# EAGLE design joltjs (EAGLE 7.7.0)
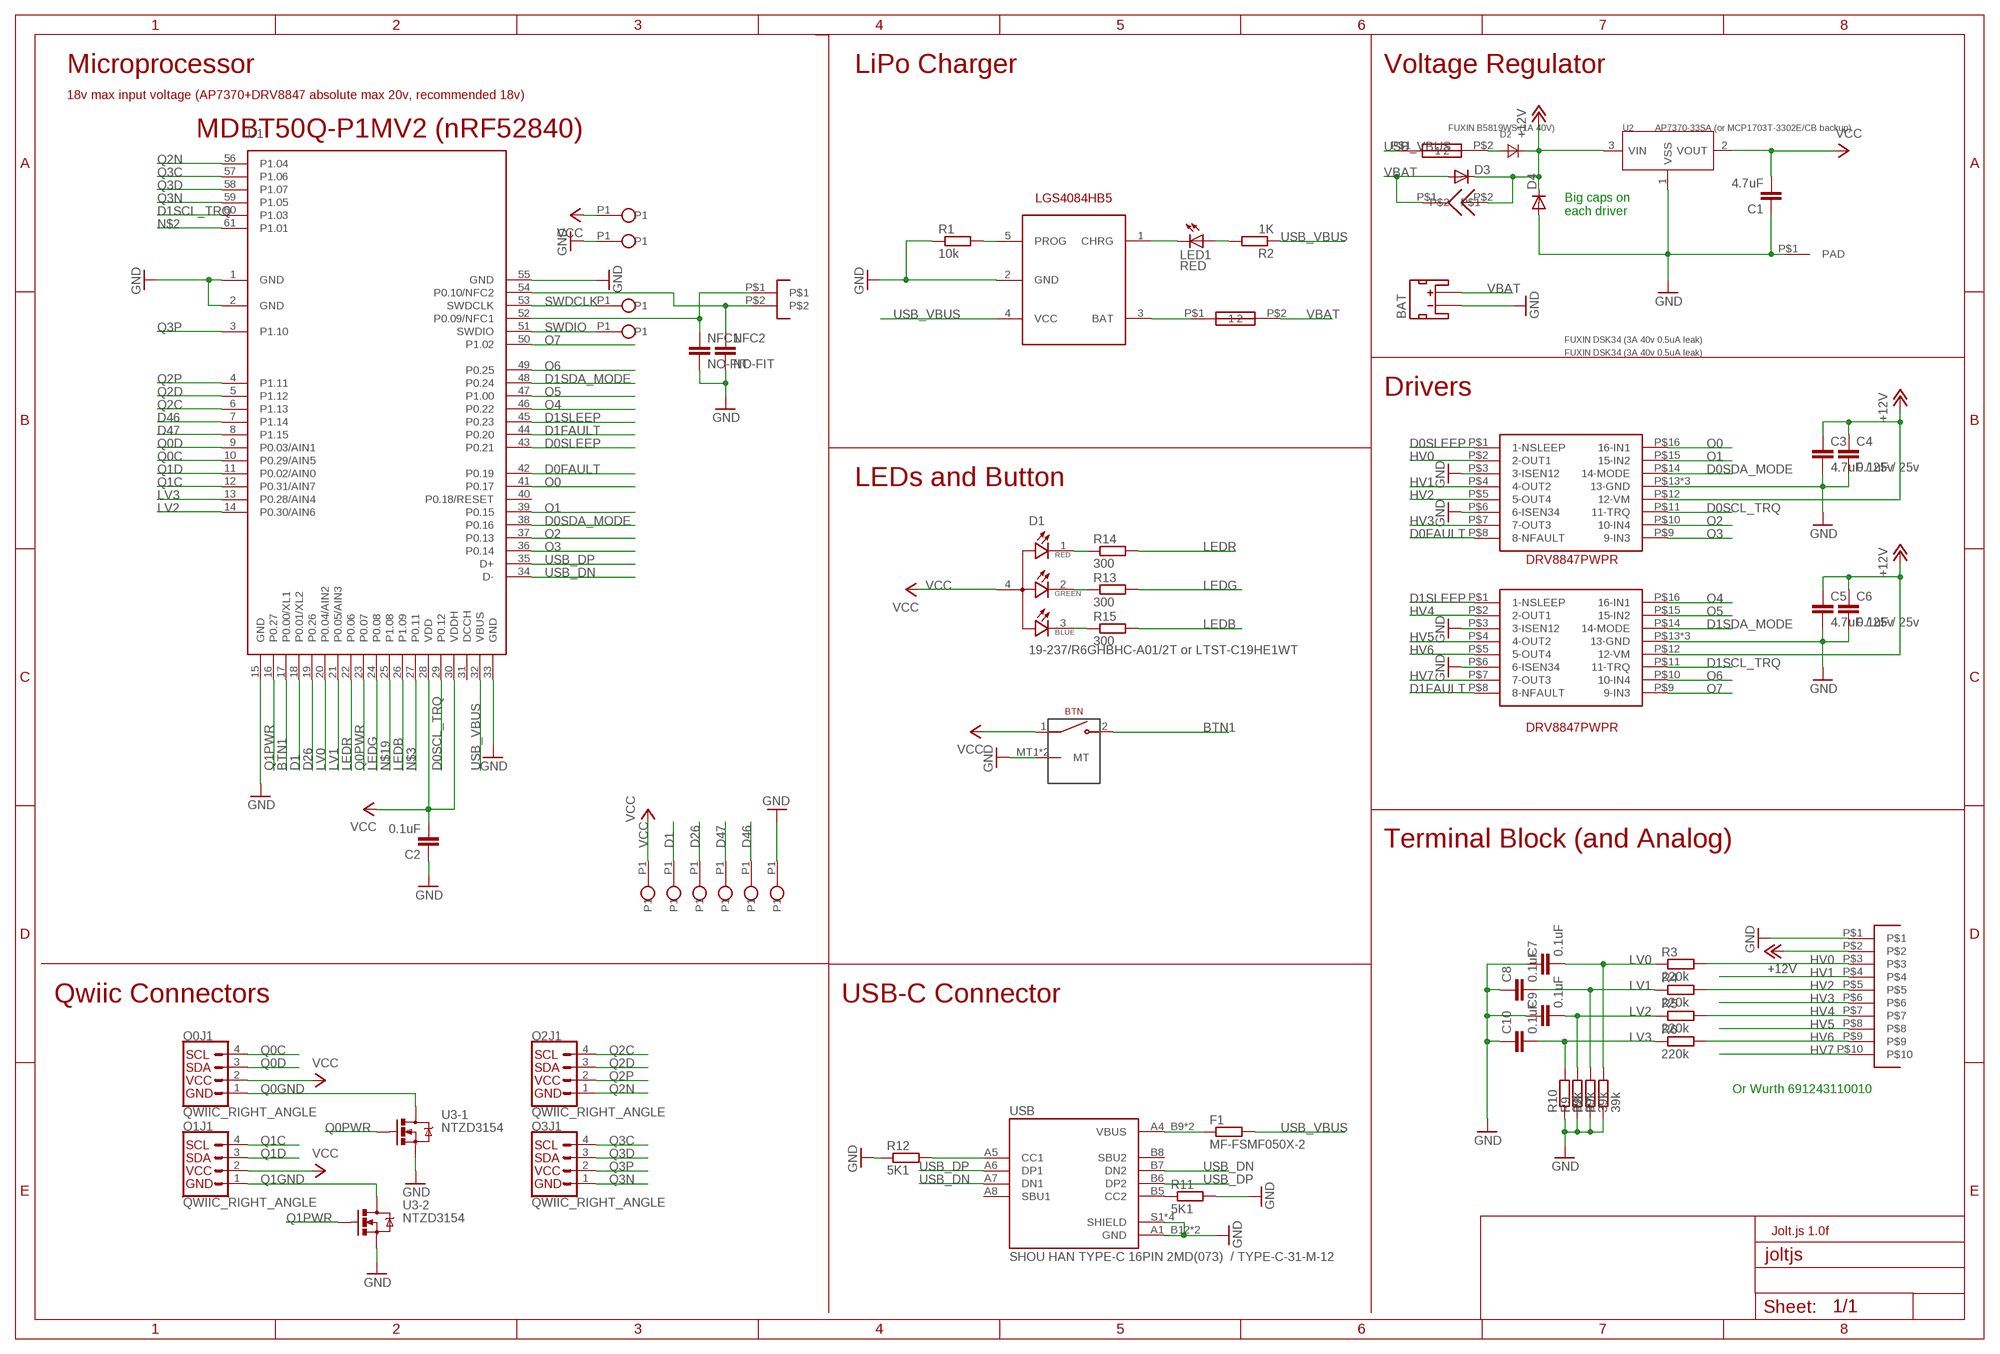
[diagram p0: schematic, sheet 1]

## Parts
BAT  C47647 / S2B-PH-SM4-TB  JST_2MM_MALE  [JST-2-SMD]
BTN  GT-TC054C  TACT_MINI_RIGHT_ANGLEMEDI  [TACT_MEDI_RIGHT_ANGLE]
C1  4.7uF  C-EUC0805  [C0805]
C2  0.1uF  C-EUC0603  [C0603]
C3  4.7uF / 25v  C-EUC0805  [C0805]
C4  0.1uF / 25v  C-EUC0603  [C0603]
C5  4.7uF / 25v  C-EUC0805  [C0805]
C6  0.1uF / 25v  C-EUC0603  [C0603]
C7  0.1uF  C-EUC0603  [C0603]
C8  0.1uF  C-EUC0603  [C0603]
C9  0.1uF  C-EUC0603  [C0603]
C10  0.1uF  C-EUC0603  [C0603]
D1  19-237/R6GHBHC-A01/2T or LTST-C19HE1WT  19-237/R6GHBHC-A01/2T  [LED_19-237/R6GHBHC-A01/2T]
D2  FUXIN B5819WS (1A 40V)  DIODE-STANDARD-SOD323  [SOD323]
D3  FUXIN DSK34 (3A 40v 0.5uA leak)  CGRM4001-G  [SOD-123_MINI-SMA]
D4  FUXIN DSK34 (3A 40v 0.5uA leak)  CGRM4001-G  [SOD-123_MINI-SMA]
F1  MF-FSMF050X-2  R-EU_R0603  [R0603]
JUMPER_LIPO_CHG  NO-FIT  WIRELINK2  [WIRELINK2]
JUMPER_LIPO_PWR  NO-FIT  SOLDERJUMPER  [SOLDERJUMPER]
JUMPER_USB_PWR  NO-FIT  WIRELINK2  [WIRELINK2]
LED1  RED  LEDCHIPLED_0603  [CHIPLED_0603]
NFC  PINHEAD-1.27-2X1  [PINHEAD-1.27-2X1]
NFC1  NO-FIT  C-EUC0603  [C0603]
NFC2  NO-FIT  C-EUC0603  [C0603]
Q0  QWIIC_RIGHT_ANGLE  QWIIC_CONNECTORJS-1MM  [JST04_1MM_RA]
Q1  QWIIC_RIGHT_ANGLE  QWIIC_CONNECTORJS-1MM  [JST04_1MM_RA]
Q2  QWIIC_RIGHT_ANGLE  QWIIC_CONNECTORJS-1MM  [JST04_1MM_RA]
Q3  QWIIC_RIGHT_ANGLE  QWIIC_CONNECTORJS-1MM  [JST04_1MM_RA]
R1  10k  R-EU_R0603  [R0603]
R2  1K  R-EU_R0603  [R0603]
R3  220k  R-EU_R0603  [R0603]
R4  220k  R-EU_R0603  [R0603]
R5  220k  R-EU_R0603  [R0603]
R6  220k  R-EU_R0603  [R0603]
R7  39k  R-EU_R0603  [R0603]
R8  39k  R-EU_R0603  [R0603]
R9  39k  R-EU_R0603  [R0603]
R10  39k  R-EU_R0603  [R0603]
R11  5K1  R-EU_R0603  [R0603]
R12  5K1  R-EU_R0603  [R0603]
R13  300  R-EU_R0603  [R0603]
R14  300  R-EU_R0603  [R0603]
R15  300  R-EU_R0603  [R0603]
SCREWHOLE  MOUNT-M3  [MOUNT-M3]
SWCK  NO-FIT  SINGLE  [SINGLE]
SWCK2  NO-FIT  SINGLE  [SINGLE]
SWD  NO-FIT  SINGLE  [SINGLE]
U1  MDBT50Q-P1MV2  MDBT50  [MDBT50]
U2  AP7370-33SA (or MCP1703T-3302E/CB backup)  MCP1703T  [SOT23A]
U3  NTZD3154  MOSFET-N-DUAL  [SOT563]
U4  LGS4084HB5  [SOT23-5]
U$5  DORABO DB125-3.5-10P-GN-S  DB125-3.5-XXP  [DB125-3.5-XXP]
UD1  DRV8847PWPR  [DRV8847PWPR]
UD2  DRV8847PWPR  [DRV8847PWPR]
USB  SHOU HAN TYPE-C 16PIN 2MD(073) / TYPE-C-31-M-12  TYPE-C-31-M-12  [HRO_TYPE-C-31-M-12]
VCC  NO-FIT  SINGLE  [SINGLE]
VCC1  NO-FIT  SINGLE  [SINGLE]
VCC2  NO-FIT  SINGLE  [SINGLE]
VCC3  NO-FIT  SINGLE  [SINGLE]
VCC4  NO-FIT  SINGLE  [SINGLE]
VCC5  NO-FIT  SINGLE  [SINGLE]
VCC6  NO-FIT  SINGLE  [SINGLE]

## Nets
+12V: C3.1 C4.1 C5.1 C6.1 D2.C D3.C D4.C JUMPER_LIPO_PWR.P$2 U2.3(VIN) U$5.P$2 UD1.P$12(12-VM) UD2.P$12(12-VM)
BTN1: BTN.2 U1.17(P0.00/XL1)
D0FAULT: U1.42(P0.19) UD1.P$8(8-NFAULT)
D0SCL_TRQ: U1.29(P0.12) UD1.P$11(11-TRQ)
D0SDA_MODE: U1.38(P0.16) UD1.P$14(14-MODE)
D0SLEEP: U1.43(P0.21) UD1.P$1(1-NSLEEP)
D1: U1.18(P0.01/XL2) VCC5.P1
D1FAULT: U1.44(P0.20) UD2.P$8(8-NFAULT)
D1SCL_TRQ: U1.60(P1.03) UD2.P$11(11-TRQ)
D1SDA_MODE: U1.48(P0.24) UD2.P$14(14-MODE)
D1SLEEP: U1.45(P0.23) UD2.P$1(1-NSLEEP)
D26: U1.19(P0.26) VCC4.P1
D46: U1.7(P1.14) VCC2.P1
D47: U1.8(P1.15) VCC3.P1
GND: BAT.1(-) BTN.MT1(MT) BTN.MT2(MT) C1.1 C2.1 C3.2 C4.2 C5.2 C6.2 C7.1 C8.1 C9.1 C10.1 D4.A NFC1.2 NFC2.2 R1.1 R7.1 R8.1 R9.1 R10.1 R11.2 R12.1 SCREWHOLE.P$1(PAD) SWCK2.P1 U1.1(GND) U1.2(GND) U1.15(GND) U1.33(GND) U1.55(GND) U2.1(VSS) U3.S1(-1:S) U3.S2(-2:S) U4.2(GND) U$5.P$1 UD1.P$3(3-ISEN12) UD1.P$6(6-ISEN34) UD1.P$13(13-GND) UD1.P$17(13-GND) UD1.P$18(13-GND) UD2.P$3(3-ISEN12) UD2.P$6(6-ISEN34) UD2.P$13(13-GND) UD2.P$17(13-GND) UD2.P$18(13-GND) USB.A1_B12(GND) USB.B1_A12(GND) USB.S1(SHIELD) USB.S2(SHIELD) USB.S3(SHIELD) USB.S4(SHIELD) VCC1.P1
HV0: R3.2 U$5.P$3 UD1.P$2(2-OUT1)
HV1: U$5.P$4 UD1.P$4(4-OUT2)
HV2: R4.2 U$5.P$5 UD1.P$5(5-OUT4)
HV3: U$5.P$6 UD1.P$7(7-OUT3)
HV4: R5.2 U$5.P$7 UD2.P$2(2-OUT1)
HV5: U$5.P$8 UD2.P$4(4-OUT2)
HV6: R6.2 U$5.P$9 UD2.P$5(5-OUT4)
HV7: U$5.P$10 UD2.P$7(7-OUT3)
LEDB: R15.2 U1.26(P1.09)
LEDG: R13.2 U1.24(P0.08)
LEDR: R14.2 U1.22(P0.06)
LV0: C7.2 R3.1 R7.2 U1.20(P0.04/AIN2)
LV1: C8.2 R4.1 R8.2 U1.21(P0.05/AIN3)
LV2: C9.2 R5.1 R9.2 U1.14(P0.30/AIN6)
LV3: C10.2 R6.1 R10.2 U1.13(P0.28/AIN4)
N$1: LED1.C U4.1(CHRG)
N$2: U1.61(P1.01)
N$3: U1.27(P0.11)
N$4: LED1.A R2.2
N$5: JUMPER_LIPO_CHG.P$1 U4.3(BAT)
N$6: NFC2.1 NFC.P$2 U1.54(P0.10/NFC2)
N$7: D2.A JUMPER_USB_PWR.P$2
N$9: R11.1 USB.B5(CC2)
N$11: NFC1.1 NFC.P$1 U1.52(P0.09/NFC1)
N$14: R12.2 USB.A5(CC1)
N$15: D1.1(R_C) R14.1
N$16: D1.2(G_C) R13.1
N$17: D1.3(B_C) R15.1
N$18: R1.2 U4.5(PROG)
N$19: U1.25(P1.08)
O0: U1.41(P0.17) UD1.P$16(16-IN1)
O1: U1.39(P0.15) UD1.P$15(15-IN2)
O2: U1.37(P0.13) UD1.P$10(10-IN4)
O3: U1.36(P0.14) UD1.P$9(9-IN3)
O4: U1.46(P0.22) UD2.P$16(16-IN1)
O5: U1.47(P1.00) UD2.P$15(15-IN2)
O6: U1.49(P0.25) UD2.P$10(10-IN4)
O7: U1.50(P1.02) UD2.P$9(9-IN3)
Q0C: Q0.4 U1.10(P0.29/AIN5)
Q0D: Q0.3 U1.9(P0.03/AIN1)
Q0GND: Q0.1 U3.D1(-1:D)
Q0PWR: U1.23(P0.07) U3.G1(-1:G)
Q1C: Q1.4 U1.12(P0.31/AIN7)
Q1D: Q1.3 U1.11(P0.02/AIN0)
Q1GND: Q1.1 U3.D2(-2:D)
Q1PWR: U1.16(P0.27) U3.G2(-2:G)
Q2C: Q2.4 U1.6(P1.13)
Q2D: Q2.3 U1.5(P1.12)
Q2N: Q2.1 U1.56(P1.04)
Q2P: Q2.2 U1.4(P1.11)
Q3C: Q3.4 U1.57(P1.06)
Q3D: Q3.3 U1.58(P1.07)
Q3N: Q3.1 U1.59(P1.05)
Q3P: Q3.2 U1.3(P1.10)
SWDCLK: SWCK.P1 U1.53(SWDCLK)
SWDIO: SWD.P1 U1.51(SWDIO)
USB_DN: U1.34(D-) USB.A7(DN1) USB.B7(DN2)
USB_DP: U1.35(D+) USB.A6(DP1) USB.B6(DP2)
USB_VBUS: F1.2 JUMPER_USB_PWR.P$1 R2.1 U1.32(VBUS) U4.4(VCC)
VBAT: BAT.2(+) D3.A JUMPER_LIPO_CHG.P$2 JUMPER_LIPO_PWR.P$1
VBUS: F1.1 USB.A4_B9(VBUS) USB.B4_A9(VBUS)
VCC: BTN.1 C1.2 C2.2 D1.4(A) Q0.2 Q1.2 U1.28(VDD) U1.30(VDDH) U2.2(VOUT) VCC6.P1 VCC.P1
Unconnected: BAT.NC1(PAD1) BAT.NC2(PAD2) Q0.NC1 Q0.NC2 Q1.NC1 Q1.NC2 Q2.NC1 Q2.NC2 Q3.NC1 Q3.NC2 U1.31(DCCH) U1.40(P0.18/RESET) USB.A8(SBU1) USB.B8(SBU2)

## Notes on the sheet
- Microprocessor | LiPo Charger | Voltage Regulator
- 18v max input voltage (AP7370+DRV8847 absolute max 20v, recommended 18v)
- MDBT50Q-P1MV2 (nRF52840)
- LGS4084HB5
- Big caps on
  each driver
- Drivers
- LEDs and Button
- DRV8847PWPR
- DRV8847PWPR
- Terminal Block (and Analog)
- Qwiic Connectors | USB-C Connector
- Or Wurth 691243110010
- Jolt.js 1.0f

## Library data of the parts
BAT = SparkFun-Connectors:JST_2MM_MALE: Mates to single-cell LiPo batteries. CONN-11443 Now with smashable polarity marks!; BTM_NEG: -; BTM_POS: +; PROD_ID: CONN-11443; TOP_NEG: -; TOP_POS: +
BTN = pimoroni-mechanical:TACT_MINI_RIGHT_ANGLE
C1-C10 NFC1 NFC2 = rcl:C-EU: CAPACITOR, European symbol
D1 = everlight_rgb:19-237/R6GHBHC-A01/2T: Check availability; AVAILABILITY: Not in stock; CHECK_PRICES: https://www.snapeda.com/parts/19237R6GHBHCA012T/Everlight+Electronics+Co+Ltd/view-part/?ref=eda; DESCRIPTION: CHIP LED RGB 0,35MM; MF: Everlight Electronics; MP: 19237R6GHBHCA012T; PACKAGE: None; PRICE: None; SNAPEDA_LINK: https://www.snapeda.com/parts/19237R6GHBHCA012T/Everlight+Electronics+Co+Ltd/view-part/?ref=snap
D2 = diode:DIODE-STANDARD-
D3 D4 = diode:CGRM400*-G: Molded plasitc,JEDEC SOD-123/Mini SMA Source: Comchip CGRM4001-G.pdf
F1 R1-R15 = rcl:R-EU_: RESISTOR, European symbol
JUMPER_LIPO_CHG JUMPER_USB_PWR = solder_jumper:WIRELINK2
JUMPER_LIPO_PWR = solder_jumper:SOLDERJUMPER
LED1 = led:LED: LED OSRAM: - CHIPLED LG R971, LG N971, LY N971, LG Q971, LY Q971, LO R971, LY R971 LH N974, LH R974 LS Q976, LO Q976, LY Q976 LO Q996 - Hyper CHIPLED LW Q18S LB Q993, LB Q99A, LB R99A - SideLED LS A670, LO A670, LY A670, LG A670, LP A670 LB A673, LV A673, LT A673, LW A673 LH A674 LY A675 LS A676, LA A676, LO A676, LY A676, LW A676 LS A679, LY A679, LG A679 - Hyper Micro SIDELED® LS Y876, LA Y876, LO Y876, LY Y876 LT Y87S - SmartLED LW L88C, LW L88S LB L89C, LB L89S, LG L890 LS L89K, LO L89K, LY L89K LS L896, LA L896, LO L896, LY L896 - TOPLED LS T670, LO T670, LY T670, LG T670, LP T670 LSG T670, LSP T670, LSY T670, LOP T670, LYG T670 LG T671, LOG T671, LSG T671 LB T673, LV T673, LT T673, LW T673 LH T674 LS T676, LA T676, LO T676, LY T676, LB T676, LH T676, LSB T676, LW T676 LB T67C, LV T67C, LT T67C, LS T67K, LO T67K, LY T67K, LW E67C LS E67B, LA E67B, LO E67B, LY E67B, LB E67C, LV E67C, LT E67C LW T67C LS T679, LY T679, LG T679 LS T770, LO T770, LY T770, LG T770, LP T770 LB T773, LV T773, LT T773, LW T773 LH T774 LS E675, LA E675, LY E675, LS T675 LS T776, LA T776, LO T776, LY T776, LB T776 LHGB T686 LT T68C, LB T68C - Hyper Mini TOPLED® LB M676 - Mini TOPLED Santana® LG M470 LS M47K, LO M47K, LY M47K Source: http://www.osram.convergy.de LUXEON: - LUMILED® LXK2-PW12-R00, LXK2-PW12-S00, LXK2-PW14-U00, LXK2-PW14-V00 LXK2-PM12-R00, LXK2-PM12-S00, LXK2-PM14-U00 LXK2-PE12-Q00, LXK2-PE12-R00, LXK2-PE12-S00, LXK2-PE14-T00, LXK2-PE14-U00 LXK2-PB12-K00, LXK2-PB12-L00, LXK2-PB12-M00, LXK2-PB14-N00, LXK2-PB14-P00, LXK2-PB14-Q00 LXK2-PR12-L00, LXK2-PR12-M00, LXK2-PR14-Q00, LXK2-PR14-R00 LXK2-PD12-Q00, LXK2-PD12-R00, LXK2-PD12-S00 LXK2-PH12-R00, LXK2-PH12-S00 LXK2-PL12-P00, LXK2-PL12-Q00, LXK2-PL12-R00 Source: www.luxeon.com KINGBRIGHT: KA-3528ASYC Source: www.kingbright.com
NFC = pinhead-127:PINHEAD-1.27-2X1
Q0 Q1-Q3 = SparkFun-Connectors:QWIIC_CONNECTOR: SparkFun I2C Standard Qwiic Connector An SMD 1mm pitch JST connector makes it easy and quick (get it? Qwiic?) to connect I2C devices to each other. The Qwiic system <http://www.sparkfun.com/qwiic> enables fast and solderless connection between popular platforms and various sensors and actuators. We carry 200mm <https://www.sparkfun.com/products/14204>, 100mm <https://www.sparkfun.com/products/14205>, 50mm <https://www.sparkfun.com/products/14206>, and breadboard friendly <https://www.sparkfun.com/products/14207> Qwiic cables. We also offer 10 pcs strips <https://www.sparkfun.com/products/14323> the SMD connectors.; PROD_ID: CONN-13694
SCREWHOLE = pimoroni:MOUNT-M3
SWCK SWCK2 SWD VCC VCC1-VCC6 = testpoint:SINGLE
U1 = MDBT50Q_171031:MDBT50: Raytac Corporation MDBT50 Bluetooth Low Energy Module based on Noridc nRF52840 Source: Raytac datasheet
U2 = mcp1703t:MCP1703T
U3 = pimoroni-ics:MOSFET-N-DUAL
U4 = lipo_chargers:LGS4084HB5
U$5 = terminal_block:DB125-3.5-XXP
UD1 UD2 = DRV8847PWPR:DRV8847PWPR
USB = USB-TYPE-C-31-M-12:TYPE-C-31-M-12: Check availability; AVAILABILITY: Not in stock; CHECK_PRICES: https://www.snapeda.com/parts/TYPE-C-31-M-12/HRO+Electronics+Co.%252C+Ltd./view-part/?ref=eda; DESCRIPTION: USB Connectors 24 Receptacle 1 8.94*7.3mm RoHS; MF: HRO Electronics Co., Ltd.; MP: TYPE-C-31-M-12; PACKAGE: Package; PRICE: None; SNAPEDA_LINK: https://www.snapeda.com/parts/TYPE-C-31-M-12/HRO+Electronics+Co.%252C+Ltd./view-part/?ref=snap

## Board
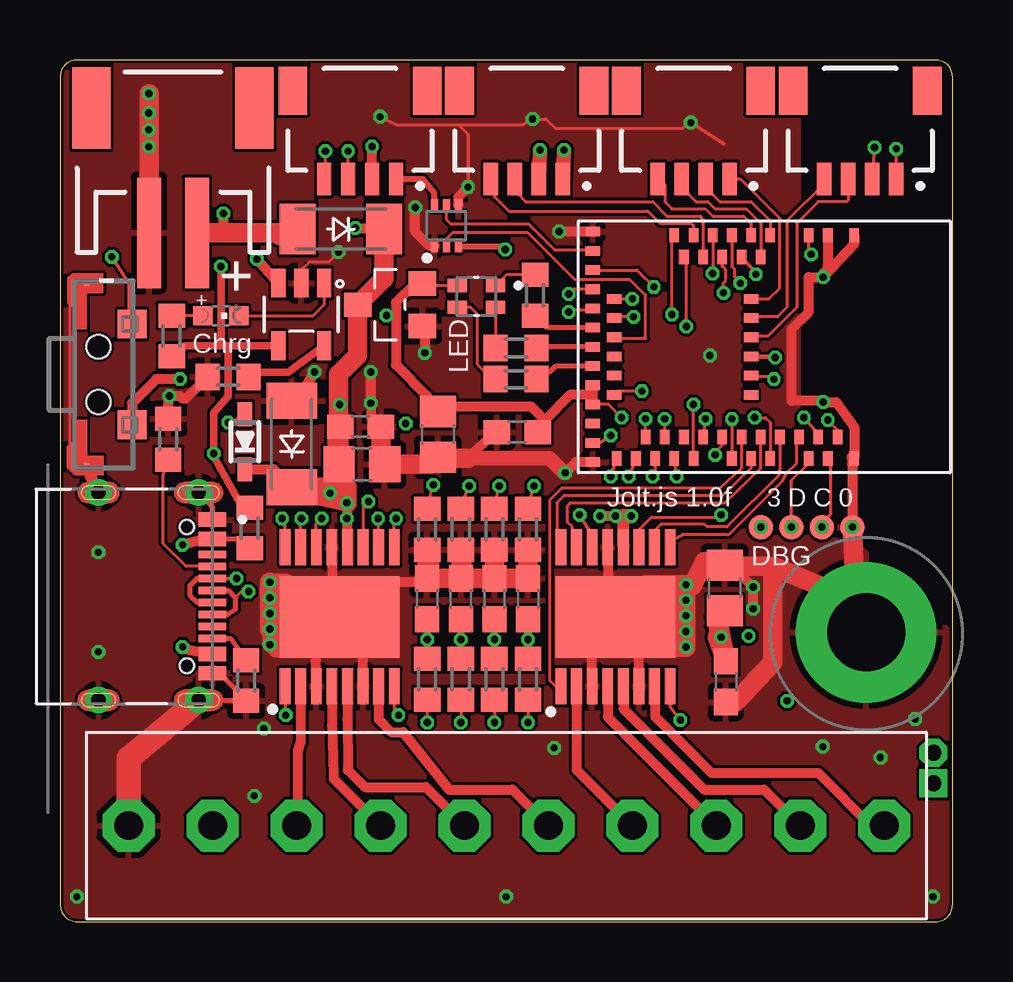
[diagram p1: board, top side]
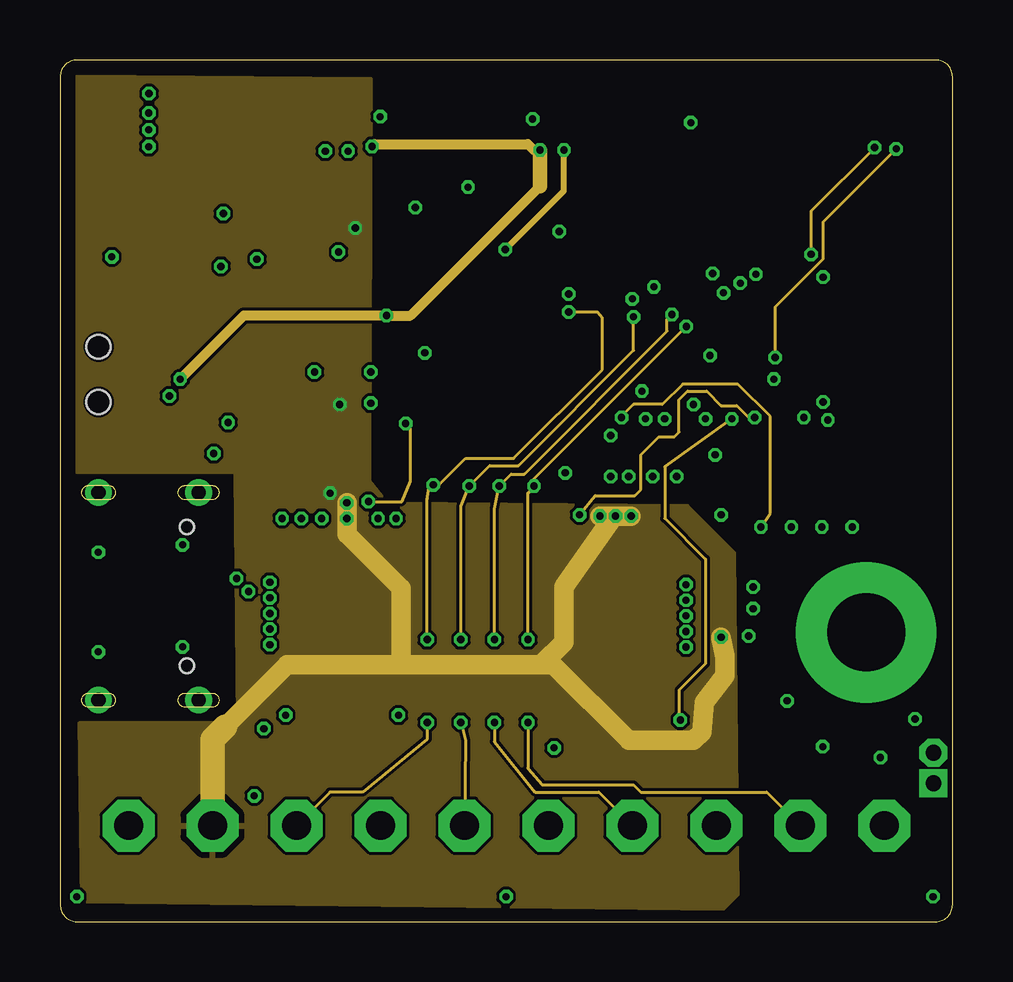
[diagram p2: board, inner layer Route2]
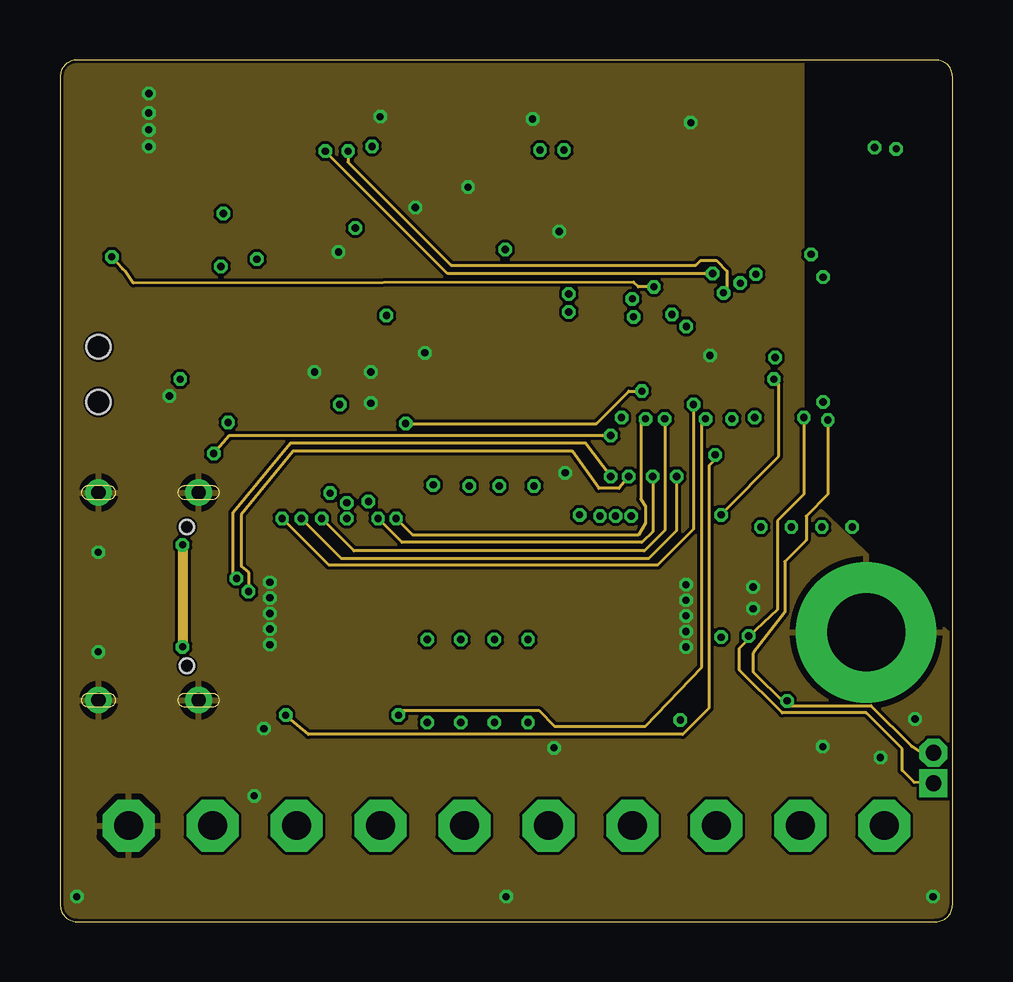
[diagram p3: board, inner layer Route15]
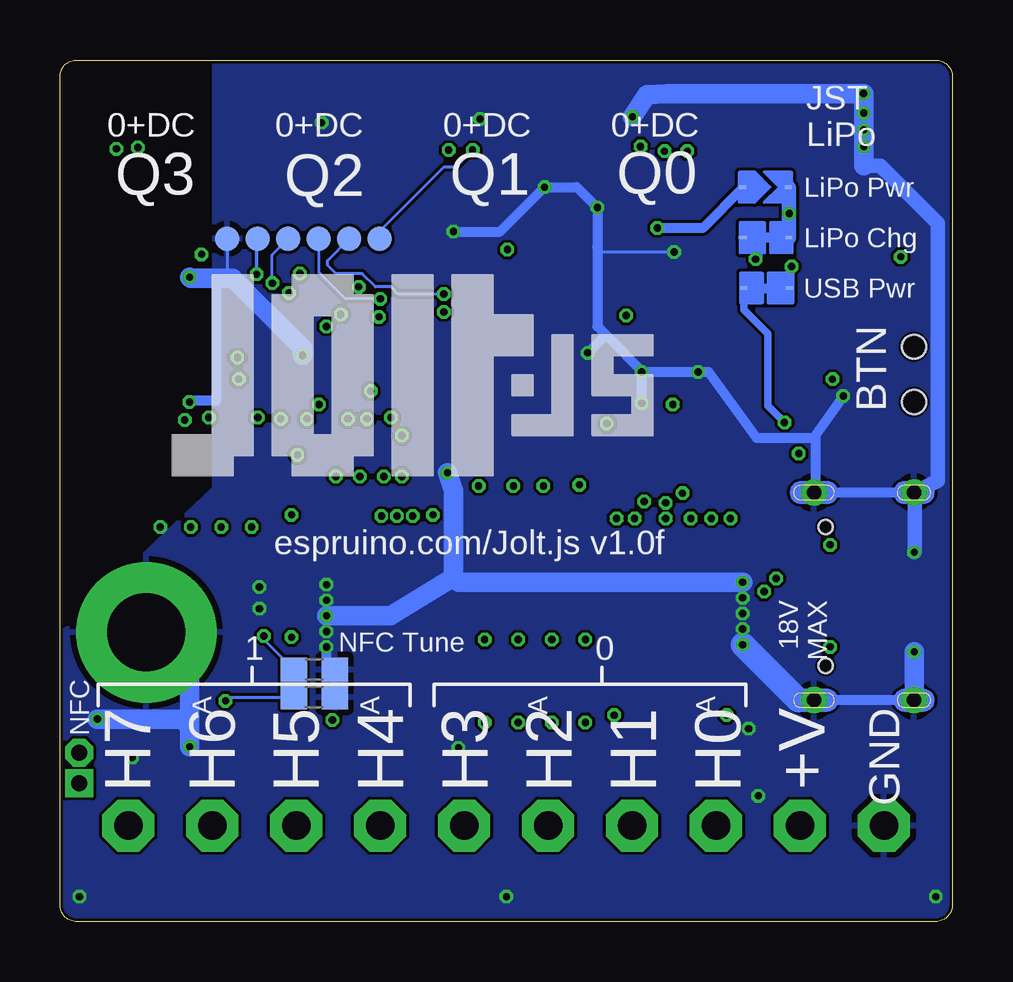
[diagram p4: board, bottom side, seen from below]

Size 37.2 x 35.9 mm. Coordinates in mm from the lower left corner, seen from the top.
Outline: 36.5,35.9 0.7,35.9 arc90 0,35.2 0,0.7 arc90 0.7,0 36.5,0 arc90 37.2,0.7 37.2,35.2 arc90 36.5,35.9
Copper layers (1+2*15+16): Top 0.035mm / dielectric 0.2mm / Route2 0.0175mm / dielectric 1.065mm / Route15 0.0175mm / dielectric 0.2mm / Bottom 0.035mm
Design rules "jlcpcb-4layers *": minimum track width 3.5mil, minimum drill 0.2mm, track to track 5mil, track to pad 5mil, pad to pad 5mil, via to via 5mil, smd to smd 5mil, copper to edge 5mil, drill to drill 6mil, minimum pad ring 10mil, minimum via ring 0.13mm, stop-mask expansion 0.05mm, vias tented up to drill 16mil, thermal gap 10mil

### Footprints (pad centres in the part's own frame; a part is rotated, then mirrored left to right if it is on the bottom)
JST-2-SMD = smd 1 x 4.6: 1 -1,-3.7; 2 1,-3.7 | smd 1.6 x 3.4: NC1 -3.4,1.5; NC2 3.4,1.5
TACT_MEDI_RIGHT_ANGLE = smd 1.2 x 1.2: 1 -2.1,-1.4; 2 2.1,-1.4 | smd 0.2 x 0.2: MT1 -3.8,0.5; MT2 3.8,0.5 | hole 1: -1.15,0; 1.15,0
C0805 = smd 1.3 x 1.5: 1 -0.95,0; 2 0.95,0
C0603 = smd 1.1 x 1: 1 -0.85,0; 2 0.85,0
LED_19-237/R6GHBHC-A01/2T = smd 0.8 x 0.55: 1 -0.8,-0.45; 2 -0.8,0.45; 3 0.8,0.45; 4 0.8,-0.45
SOD323 = smd 1 x 0.6: A 1.143,0; C -1.143,0
SOD-123_MINI-SMA = smd 1.5 x 2.1: A 1.8,0; C -1.8,0
R0603 = smd 1 x 1.1: 1 -0.85,0; 2 0.85,0
WIRELINK2 = smd 0.305 x 0.152: P$1 1.016,0; P$2 -0.889,0
SOLDERJUMPER = smd 0.305 x 0.152: P$1 0.762,0; P$2 -1.143,0
CHIPLED_0603 = smd 0.8 x 0.8: A 0,-0.75; C 0,0.75
PINHEAD-1.27-2X1 = drill 0.65 pad 1.016 square: P$1 0,0.635 | drill 0.65 pad 1.016 octagon: P$2 0,-0.635
JST04_1MM_RA = smd 0.6 x 1.35: 1 -1.5,0; 2 -0.5,0; 3 0.5,0; 4 1.5,0 | smd 1.2 x 2: NC1 2.8,-3.675; NC2 -2.8,-3.675
MOUNT-M3 = drill 3.25 pad 5.5: P$1 0,0
SINGLE = smd 1.016 x 1.016: P1 0,0
MDBT50 = smd 0.6 x 0.4: 1 -4.65,3.75; 2 -4.65,2.65; 3 -4.65,1.85; 4 -4.65,0.25; 5 -3.75,-0.15; 6 -4.65,-0.55; 7 -3.75,-0.95; 8 -4.65,-1.35; 9 -3.75,-1.75; 10 -4.65,-2.15; 11 -3.75,-2.55; 12 -4.65,-2.95; 13 -3.75,-3.35; 14 -4.65,-3.75; 34 4.65,-6.15; 35 4.65,-5.35; 36 3.75,-4.95; 37 4.65,-4.55; 38 3.75,-4.15; 39 4.65,-3.75; 40 3.75,-3.35; 41 4.65,-2.95; 42 3.75,-2.55; 43 3.75,-1.75; 44 4.65,-1.35; 45 3.75,-0.95; 46 4.65,-0.55; 47 3.75,-0.15; 48 4.65,0.25; 49 3.75,0.65; 50 3.75,1.45; 51 4.65,1.85; 52 3.75,2.25; 53 4.65,2.65; 54 3.75,3.05; 55 4.65,3.75 | smd 0.4 x 0.6: 15 -4.8,-7.15; 16 -4,-7.15; 17 -3.2,-7.15; 18 -2.4,-7.15; 19 -2,-6.25; 20 -1.6,-7.15; 21 -1.2,-6.25; 22 -0.8,-7.15; 23 -0.4,-6.25; 24 0,-7.15; 25 0.4,-6.25; 26 0.8,-7.15; 27 1.2,-6.25; 28 1.6,-7.15; 29 2,-6.25; 30 2.4,-7.15; 31 3.2,-7.15; 32 4,-7.15; 33 4.8,-7.15; 56 -2,-0.55; 57 -1.2,-0.55; 58 -0.4,-0.55; 59 0.4,-0.55; 60 1.2,-0.55; 61 2,-0.55
SOT23A = smd 1.016 x 1.143: 1 -0.889,-1.35; 2 0.889,-1.35; 3 0,1.35
SOT563 = smd 0.3 x 0.5: D1 0.5,-0.85; D2 -0.5,0.85; G1 0,0.85; G2 0,-0.85; S1 0.5,0.85; S2 -0.5,-0.85
SOT23-5 = smd 1.2 x 0.6: 1 -1.306,0.95; 2 -1.306,0; 3 -1.306,-0.95; 4 1.306,-0.95; 5 1.306,0.95
DB125-3.5-XXP = drill 1.2 octagon: P$1 -15.75,0; P$2 -12.25,0; P$3 -8.75,0; P$4 -5.25,0; P$5 -1.75,0; P$6 1.75,0; P$7 5.25,0; P$8 8.75,0; P$9 12.25,0; P$10 15.75,0
DRV8847PWPR = smd 1.5 x 0.45: P$1 -2.9,2.275; P$2 -2.9,1.625; P$3 -2.9,0.975; P$4 -2.9,0.325; P$5 -2.9,-0.325; P$6 -2.9,-0.975; P$7 -2.9,-1.625; P$8 -2.9,-2.275; P$9 2.9,-2.275; P$10 2.9,-1.625; P$11 2.9,-0.975; P$12 2.9,-0.325; P$13 2.9,0.325; P$14 2.9,0.975; P$15 2.9,1.625; P$16 2.9,2.275 | smd 2.46 x 2.31: P$17 0,0 | smd 3.4 x 5: P$18 0,0
HRO_TYPE-C-31-M-12 = smd 0.6 x 1.14: A1_B12 -3.2,4.75; A4_B9 -2.4,4.75; B1_A12 3.2,4.75; B4_A9 2.4,4.75 | smd 0.3 x 1.14: A5 -1.25,4.75; A6 -0.25,4.75; A7 0.25,4.75; A8 1.25,4.75; B5 1.75,4.75; B6 0.75,4.75; B7 -0.75,4.75; B8 -1.75,4.75 | drill 0.6 pad 0.9: S1 -4.325,4.17; S2 4.325,4.17; S3 -4.325,0; S4 4.325,0 | hole 0.6: -2.89,3.68; 2.89,3.68

### Placement (x,y rotation side)
BAT  4.7,32.4 0 top
BTN  1.6,22.8 90 top
C1  15.75,20.3 90 top
C2  19.05,20.4 0 top
C3  12.58,19.06 0 top
C4  12.52,20.62 0 top
C5  27.7,13.9 90 top
C6  27.75,10 270 top
C7  15.3,13.45 270 top
C8  16.7,13.45 270 top
C9  18.1,13.45 270 top
C10  19.5,13.45 270 top
D1  17.35,26.05 180 top
D2  7.7,20 90 top
D3  11.7,28.85 180 top
D4  9.65,19.9 90 top
F1  7.9,16.4 90 top
JUMPER_LIPO_CHG  7.7,28.5 180 bottom
JUMPER_LIPO_PWR  7.6,30.6 0 bottom
JUMPER_USB_PWR  7.8,26.4 0 bottom
LED1  6.7,25.25 270 top
NFC  36.4,6.4 180 top
NFC1  26.6,10.5 0 bottom
NFC2  26.6,9.35 0 bottom
Q0  12.5,30.95 180 top
Q1  19.45,30.95 180 top
Q2  26.4,30.95 180 top
Q3  33.35,30.95 180 top
R1  7,22.7 0 top
R2  4.65,24.4 90 top
R3  15.3,10.1 270 top
R4  16.7,10.1 270 top
R5  18.1,10.1 270 top
R6  19.5,10.1 270 top
R7  15.3,16.35 90 top
R8  16.7,16.35 90 top
R9  18.1,16.35 90 top
R10  19.5,16.35 90 top
R11  7.75,10.05 270 top
R12  4.5,20.1 270 top
R13  19,23.9 0 top
R14  19.8,26.1 270 top
R15  19,22.6 0 top
SCREWHOLE  33.6,12.05 0 top
SWCK  31.75,16.44 0 top
SWCK2  33.02,16.44 0 top
SWD  30.48,16.44 0 top
U1  29.35,23.95 270 top
U2  13.75,25.7 90 top
U3  16.1,29 180 top
U4  10.05,25.3 270 top
U$5  18.6,4 0 top
UD1  11.65,12.7 90 top
UD2  23.15,12.7 90 top
USB  1.6,13.55 270 top
VCC  29.21,16.44 0 top
VCC1  30.23,28.45 0 bottom
VCC2  28.96,28.45 0 bottom
VCC3  27.69,28.45 0 bottom
VCC4  26.42,28.45 0 bottom
VCC5  25.15,28.45 0 bottom
VCC6  23.88,28.45 0 bottom

### Tracks (layer width: path | path; a pad name or v marks a point on that pad's centre or on a via)
+12V  (via drill 0.3)
  Top 0.406: v11.95,17.45 11.95,15.62 UD1.P$12 | UD2.P$12 23.48,15.62 | 23.48,16.9 v22.5,16.9 | D2.C 8.89,18.86 D4.C | v11.65,21.55 11.65,20.64 C4.1 | v12.3,28.9 13.45,28.9 D3.C
  Top 0.5: 23.48,15.62 23.48,16.9
  Top 0.61: 23.48,16.9 v23.8,16.9
  Top 0.813: v27.55,11.85 27.4,11.85 C6.1 27.35,12.7 C5.1 | 11.45,18.4 11.45,18.88 C3.1 11.63,20.57 C4.1 11.6,20.69 11.6,22.8 12.4,23.6 U2.3 13.5,26.8 D3.C | 11.7,20.55 11.55,20.4 11.55,18.5 11.45,18.4 | 11.45,18.4 11.95,18.1 | 11.95,18.1 11.95,17.5 | 11.95,17.5 v11.95,17.45 | D4.C 11.95,18.1 | 10.55,17.8 11.95,17.5
  Route2 0.406: v23.8,16.9 23.05,16.9 | v23.15,16.9 23.65,16.7 23.05,16.85
  Route2 0.813: v11.95,17.45 v11.95,16.8 11.95,16.15 14.2,13.9 14.2,10.7 | 23.05,16.85 21,13.95 21,11.65 20.05,10.7 | 20.05,10.7 14.2,10.7 | v27.55,11.85 27.7,11.05 27.7,10.25 26.85,9.15 26.75,7.9 26.4,7.55 23.7,7.55 20.55,10.7 20.05,10.7 | v22.5,16.9 23.05,16.9 v23.15,16.9 v23.8,16.9 | 14.2,10.7 9.45,10.7 6.88,8.12
  Route2 1.016: U$5.P$2 6.35,7.6 6.88,8.12
  Bottom 0.406: JUMPER_LIPO_PWR.P$2 8.74,30.56 10.4,28.9 v12.3,28.9
  other vias: 11.25,17.85
  pour Route2: 0.7,35.25 12.95,35.15 12.9,18.4 13.65,17.45 26.15,17.35 28.1,15.4 28.25,1.1 27.65,0.5 0.9,0.8 0.8,8.3 7.4,8.3 7.3,18.7 0.7,18.7
BTN1  (via drill 0.3)
  Top 0.127: U1.17 24.05,27.15 v24.75,26.45 | v2.15,27.7 2.85,26.6 2.85,25.05 BTN.2
  Route15 0.127: v24.75,26.45 24.1,26.45 23.9,26.65 3.05,26.6 2.7,27.1 2.6,27.2 v2.15,27.7
D0FAULT  (via drill 0.3)
  Top 0.127: UD1.P$8 13.93,8.78 v14.1,8.6 | v26.9,20.95 U1.42
  Route15 0.127: v14.1,8.6 14.1,8.8 19.95,8.8 20.6,8.15 24.4,8.15 26.75,10.6 26.75,20.9 v26.9,20.95
D0SCL_TRQ  (via drill 0.3)
  Top 0.127: UD1.P$11 12.65,15.6 12.65,17.3 v12.85,17.5 | v24.25,22.1 23.25,22.1 U1.29
  Route2 0.127: v12.85,17.5 14.25,17.5 14.6,18.35 14.6,20.55 v14.4,20.75
  Route15 0.127: v14.4,20.75 22.35,20.75 23.7,22.1 v24.25,22.1
D0SDA_MODE  (via drill 0.3)
  Top 0.127: U1.38 v25.2,20.95 | UD1.P$14 10.68,16.57 v10.9,16.8
  Route15 0.127: v25.2,20.95 25.2,16.3 24.35,15.45 12.25,15.45 v10.9,16.8
D0SLEEP  (via drill 0.3)
  Top 0.127: U1.43 27.6,19.85 27.4,19.65 27.4,19.55 v27.3,19.45 | v9.4,8.6 9.4,9.78 UD1.P$1
  Route15 0.127: v27.3,19.45 27.3,19.25 27.05,19 27.05,8.9 25.95,7.8 10.35,7.8 v9.4,8.6
D1  (via drill 0.3)
  Top 0.127: U1.18 21.4,26.35 v21.2,26.15
  Bottom 0.127: v21.2,26.15 23.1,26.15 23.4,26.45 24.05,26.45 24.6,27 25.7,27 26.05,27.35 26.05,27.54 VCC5.P1
D1FAULT  (via drill 0.3)
  Top 0.127: 25.43,9.07 25.43,8.97 v25.85,8.4 | v28,20.95 U1.44
  Top 0.2: UD2.P$8 25.43,9.07
  Route2 0.127: v28,20.95 25.2,18.95 25.2,16.8 26.9,15.1 26.9,10.75 25.8,9.65 25.8,8.65 v25.85,8.4
D1SCL_TRQ  (via drill 0.3)
  Top 0.127: UD2.P$11 24.12,16.32 24.65,16.85 27.4,16.85 v27.55,16.95 | v29.75,22.6 29.65,22.7 28.85,22.7 U1.60
  Route15 0.127: v27.55,16.95 29.95,19.4 29.95,22.4 v29.75,22.6
D1SDA_MODE  (via drill 0.3)
  Top 0.127: UD2.P$14 22.2,15.68 22,16.4 v21.65,16.95 | v28.95,21 29.4,21 29.6,20.8 U1.48
  Route2 0.127: v21.65,16.95 22.3,17.75 23.95,17.75 24.2,18 24.2,19.45 24.95,20.2 25.6,20.2 25.8,20.4 25.8,21.75 26.15,22.1 26.95,22.1 27.55,21.5 28.2,21.5 28.7,21 v28.95,21
D1SLEEP
  Top 0.127: U1.45 28.4,18.9 27.5,18.05 20.9,18.05 20.4,17.55 20.4,10.05 20.65,9.8 UD2.P$1 20.75,9.68
D26  (via drill 0.3)
  Top 0.127: U1.19 v23.85,25.95
  Bottom 0.127: v23.85,25.95 25.3,25.95 26.4,27.05 26.4,28.43 VCC4.P1
D46  (via drill 0.3)
  Top 0.15: U1.7 28.75,27.33 v29,26.97
  Bottom 0.15: v29,26.97 29,28.24 VCC2.P1
D47  (via drill 0.3)
  Top 0.127: U1.8 28,27.3 28.1,27.2 28.1,26.9 v28.35,26.6
  Bottom 0.127: v28.35,26.6 28.35,27.78 VCC3.P1
GND  (via drill 0.3)
  Top 0.127: U1.55 33,19.35 | 27.68,32.4 v26.29,33.29 25.95,33.05 20.65,33.05 20.26,33.44 v19.69,33.44 19.25,33.2 16.6,33.2 | v13.34,33.54 13.31,33.54 14.05,33.2 16.6,33.2 | BTN.MT2 1.1,26.45 0.4,25.75 0.4,19.7 BTN.MT1 | 16.6,33.2 17,32.8 v17,30.6 | U4.2 10.05,27.15 10.4,27.5 11.2,27.5 v11.6,27.9
  Top 0.2: USB.B1_A12 6.65,10.35 R11.2 5.79,9.2 USB.S2 | USB.A1_B12 6.35,17.3 USB.S1
  Top 0.406: UD2.P$3 22.18,11.78 UD2.P$18 | UD2.P$6 24.12,11.78 UD2.P$18 | UD1.P$3 10.68,11.78 UD1.P$18 | UD1.P$6 12.62,11.78 UD1.P$18 | UD2.P$13 22.82,13.07 UD2.P$18 | 24.12,13.72 23.93,13.52 UD2.P$18 | 12.62,13.72 UD1.P$18 | UD1.P$13 11.32,13.07 UD1.P$18 | R12.1 4.5,21.45 v4.55,21.9 4.99,21.9 5.1,21.79 5.24,21.79 R1.1 | v12.95,22.9 v12.95,21.6 12.95,21.04 C4.2 | 13.37,19.21 C3.2 | U3.S1 15.4,28.15 14.8,28.75 v14.8,29.75 | U3.S2 16.6,30.2 v17,30.6 | U1.15 v20.8,28.75 | U1.33 21.5,19.15 v21.05,18.7 | U1.1 33.1,28.25 v31.8,26.85 | U1.55 33.1,20.6 32.35,21.65 v31.8,21.65 31.7,21.7 30.5,21.7 30.5,24.7 31.2,25.4 31.2,26.85 v31.8,26.85 | U1.2 32,27.2 31.8,27 v31.8,26.85 | USB.S3 BTN.MT1 1.05,18.95 1.55,17.9 | C10.1 19.34,14.14 13.15,14.14 11.85,12.84 v8.74,12.84 | 33,19.35 33.02,19.05 SWCK2.P1 | C2.1 18.1,20.4 17,19.3 | 15.8,19.3 C1.1 | D4.A 9.9,21.7 v10.6,22.9 | U2.1 15.2,24.71 v15.2,23.7 | v28.89,13.04 v28.89,13.94 27.98,14.85 C5.2
  Top 0.61: v8.74,11.54 9.04,11.84 9.09,11.84 | v8.74,11.54 v8.74,12.84 8.74,12.41 9.85,11.3 8.98,11.3 v8.74,11.54 | 17,19.3 20.4,19.3 21,18.7 v21.05,18.7
  Top 0.813: C4.2 13.37,19.21 | v26.09,13.39 v26.09,14.04 24.44,14.04 24.12,13.72 | v26.09,13.39 v26.09,12.74 | v26.09,12.74 v26.09,12.09 | v26.09,12.09 v26.09,11.44 24.31,11.44 24.3,11.45 24.3,12.2 26.1,14 26.35,14 26.85,15 27.2,15 C5.2 28.2,14.8 29.7,14.8 | v26.09,13.39 24.05,13.39 23.93,13.52 | v26.09,12.74 24.14,12.74 23.65,13.23 | v26.09,12.09 24.44,12.09 24.12,11.78 | 29.7,14.8 29.7,10.8 28.15,9.15 C6.2 | 29.7,14.8 32.5,13.65 SCREWHOLE.P$1 33.19,12.94 SWCK2.P1 | R10.1 C10.1 C9.1 | R9.1 C9.1 | C7.1 R7.1 15.4,15.4 15.4,14.3 C8.1 R8.1 16.75,15.45 16.75,14.3 C9.1 | v8.74,14.14 8.88,14 9.5,14 9.4,14.1 8.75,14.1 8.74,14.09 v8.74,13.49 v8.74,12.84 v8.74,12.19 9.09,11.84 9.15,11.78 10.68,11.78 | 17,19.3 15.8,19.3 | C1.1 15.46,19.05 C3.2 | BAT.1 v3.7,34.5
  Top 1.016: U$5.P$1 2.85,6.8 USB.S2
  Bottom 0.127: 31.85,8.3 v31.79,7.29 | v11.6,27.9 14.6,27.9 14.8,28.1 | VCC1.P1 30.23,26.88 30.15,26.8
  Bottom 0.406: v4.55,21.9 5.8,20.15 | 5.8,20.15 8.15,20.15 10.15,22.9 v10.6,22.9 v12.95,22.9 12.85,22.85 | v12.95,21.6 12.95,22.75 12.85,22.85 | 14.45,24.45 14.8,24.8 14.8,28.1 v14.8,29.75 15.65,30.6 v17,30.6 18.85,28.75 v20.8,28.75 | 14.45,24.45 12.85,22.85 | v31.8,26.85 30.75,26.85 30.7,26.8 30.7,21.7 31.8,21.7 v31.8,21.65 | 1.55,17.9 1.57,17.88 USB.S3 USB.S1 5.8,17.91 5.7,18.3 5.7,20.15 5.8,20.15 | USB.S4 USB.S2 6.42,9.22 | v15.2,23.7 14.45,24.45 | NFC2.2 NFC1.2 26.09,10.84 v26.09,11.44
  Bottom 0.61: 3.7,31.5 3,31.5 0.6,29.1 0.6,18.38 USB.S3 | 1.57,17.88 1.57,15.4 v1.59,15.39
  Bottom 0.813: v21.05,18.7 20.8,17.95 20.8,14.35 | 20.8,14.35 23.41,12.74 v26.09,12.74 | 20.8,14.35 20.59,14.14 v8.74,14.14 | v13.34,33.54 12.74,34.46 11.9,34.5 v3.7,34.5 v3.7,32.28 | 3.7,31.5 v3.7,32.28 | v3.7,32.28 v3.69,32.29 v3.69,32.99 v3.69,33.69 | v1.59,11.24 USB.S4 | v27.09,23.59 27.09,23.89 30,26.8 30.15,26.8 31.75,26.8 v31.8,26.85 | v31.79,7.29 31.79,8.1 | 31.79,8.1 31.79,10.24 SCREWHOLE.P$1 | v35.64,8.44 32.13,8.44 31.79,8.1
  Bottom 1.016: v8.74,11.54 6.42,9.22
  other vias: 33.02,16.44 20.59,7.24 18.59,1.04 36.39,1.04 0.69,1.04 8.49,8.04 8.09,5.24 34.19,6.84
  pour Top: 0,35.9 30.75,35.9 30.75,18 37.2,11.95 37.15,0.15 0,0.1
  pour Bottom: 0,35.9 30.75,35.9 30.75,18.05 37.2,11.95 37.25,0.15 0.1,0.1
  pour Route15: 0.05,35.85 30.95,35.85 30.95,17.9 37.2,11.9 37.2,0.1 0.05,0.1
HV0  (via drill 0.3)
  Top 0.127: R3.2 v15.3,8.3
  Top 0.406: UD1.P$2 10.03,7.47 9.9,7.1 9.9,4.05 U$5.P$3
  Route2 0.127: U$5.P$3 11.25,5.4 12.6,5.4 15.3,7.6 v15.3,8.3
HV1
  Top 0.406: UD1.P$4 11.32,8.18 11.4,6.1 11.4,5.95 U$5.P$4
  Route2 0.127: 13.3,4.05 U$5.P$4
HV2  (via drill 0.3)
  Top 0.127: R4.2 v16.7,8.3
  Top 0.406: UD1.P$5 11.97,8.43 12,6.4 12,6.3 12.7,5.6 15.25,5.6 U$5.P$5
  Route2 0.127: v16.7,8.3 16.9,7.55 U$5.P$5
HV3
  Top 0.406: UD1.P$7 13.28,8.43 13.8,7.9 14.3,7.9 16.2,5.5 18.85,5.5 U$5.P$6
HV4  (via drill 0.3)
  Top 0.127: R5.2 v18.1,8.3
  Top 0.406: UD2.P$2 21.52,6.33 U$5.P$7
  Route2 0.127: v18.1,8.3 18.1,7.5 19.8,5.4 22.45,5.4 U$5.P$7
HV5
  Top 0.406: UD2.P$4 22.82,8.53 U$5.P$8
HV6  (via drill 0.3)
  Top 0.127: R6.2 v19.5,8.3
  Top 0.406: UD2.P$5 23.5,9.78 23.5,8.85 26.85,5.5 29.35,5.5 U$5.P$9
  Route2 0.127: v19.5,8.3 19.5,6.4 20.1,5.7 23.9,5.7 24.2,5.4 29.45,5.4 U$5.P$9
HV7
  Top 0.406: UD2.P$7 24.8,9.78 24.8,8.55 27.15,6.2 31.6,6.2 33.8,4 U$5.P$10
LEDB
  Top 0.2: U1.26 20.65,23.15 20.4,22.9 20.15,22.9 R15.2
LEDG
  Top 0.2: U1.24 19.9,23.95 R13.2
LEDR
  Top 0.2: U1.22 20.3,24.75 R14.2
LV0  (via drill 0.3)
  Top 0.127: R7.2 v15.55,18.2 | v21.2,25.4 21.3,25.5 22.05,25.5 U1.20 | R3.1 v15.3,11.75 C7.2
  Route2 0.127: v21.2,25.4 22.4,25.4 22.6,25.15 22.6,23 18.9,19.3 16.9,19.3 15.8,18.2 v15.55,18.2 15.4,18.2 15.3,17.6 v15.3,11.75
LV1  (via drill 0.3)
  Top 0.127: R8.2 16.7,17.3 v17.05,18.15 | v23.9,25.2 23.15,25.2 U1.21 | 16.7,12.4 C8.2 v16.7,11.75 R4.1
  Route2 0.127: v23.9,25.2 23.9,23.8 19.1,19 17.9,19 v17.05,18.15 16.7,17.3 v16.7,11.75
LV2  (via drill 0.3)
  Top 0.127: R9.2 v18.3,18.15 | v25.5,25.3 25.5,28.5 U1.14 | R5.1 v18.1,11.75 C9.2
  Route2 0.127: v25.5,25.3 25.3,25.1 25.3,24.6 19.35,18.65 18.8,18.65 v18.3,18.15 R9.2 v18.1,11.75
LV3  (via drill 0.3)
  Top 0.127: R10.2 v19.75,18.15 | v26.1,24.8 26.1,27.6 U1.13 | R6.1 v19.5,11.75 C10.2
  Route2 0.127: v26.1,24.8 19.6,18.3 v19.75,18.15 19.5,17.85 v19.5,11.75
N$1
  Top 0.127: U4.1 11,25.7 10.55,25.25 LED1.C
N$4
  Top 0.127: LED1.A R2.2
N$5  (via drill 0.3)
  Top 0.406: v8.2,27.6 9.01,26.7 U4.3
  Bottom 0.406: JUMPER_LIPO_CHG.P$1 8.7,28.5 8.1,27.9 v8.2,27.6
N$6  (via drill 0.3)
  Top 0.127: U1.54 32.5,20.2 32.5,20.4 v32,20.9
  Route15 0.127: v32,20.9 32,17.8 31.1,16.9 31.1,15.9 30.2,15 30.2,12.9 28.9,11.2 28.9,10.4 30.23,9.07 | NFC.P$2 35.9,7.04 35.5,7.3 33.8,9 30.3,9 30.23,9.07 | v30.3,9.2 30.23,9.12 30.23,9.07
  Bottom 0.127: v30.3,9.2 30.15,9.35 NFC2.1
N$7  (via drill 0.3)
  Top 0.305: v7,20.8 7.36,20.8 D2.A
  Bottom 0.305: JUMPER_USB_PWR.P$2 8.69,25.49 7.7,24.5 7.7,21.5 v7,20.8
N$9
  Top 0.2: USB.B5 7.1,11.8 R11.1
N$11  (via drill 0.3)
  Top 0.127: U1.52 31.6,20.3 v31,21
  Route15 0.127: v31,21 31,17.8 29.9,16.7 29.9,13 v28.7,11.9 28.7,11.78 28.32,11.4 28.32,10.48 30.1,8.7 33.6,8.7 35.1,7.2 35.1,6.3 35.6,5.8 NFC.P$1
  Bottom 0.127: NFC1.1 28.7,11.75 v28.7,11.9
N$14
  Top 0.127: USB.A5 5.25,14.8 4.3,15.75 4.3,18.6 R12.2
N$15
  Top 0.127: R14.1 18.6,26.95 D1.1
N$16
  Top 0.127: D1.2 R13.1
N$17
  Top 0.127: R15.1 18,22.6 17.4,23.2 17.4,25.3 17.1,25.6 D1.3
N$18
  Top 0.305: R1.2 8,22.9 9.51,22.9 U4.5
O0  (via drill 0.3)
  Top 0.127: UD1.P$16 9.38,16.62 v9.25,16.8 | U1.41 v26.4,21.55
  Route15 0.127: v26.4,21.55 26.4,16.35 24.9,14.85 11.2,14.85 v9.25,16.8
O1  (via drill 0.3)
  Top 0.127: UD1.P$15 10.03,16.77 v10.05,16.8 | v25.7,18.55 U1.39
  Route15 0.127: v25.7,18.55 25.7,16.3 24.55,15.15 11.7,15.15 v10.05,16.8
O2  (via drill 0.3)
  Top 0.127: 13.3,15.62 UD1.P$10 13.28,16.77 v13.25,16.8 | U1.37 24.8,18.6 v24.7,18.55
  Route15 0.127: 13.28,16.73 v13.25,16.8 14.25,15.8 24.25,15.8 24.7,16.25 v24.7,18.55
O3  (via drill 0.3)
  Top 0.127: UD1.P$9 13.93,16.82 v14,16.8 | U1.36 v24.4,20.95
  Route15 0.127: v24.4,20.95 24.2,20.95 24.2,17.6 24.4,17.3 24.4,16.6 24.1,16.1 14.7,16.1 v14,16.8
O4
  Top 0.127: U1.46 28.8,18.9 27.6,17.75 21,17.75 20.7,17.45 20.7,15.88 UD2.P$16
O5
  Top 0.127: UD2.P$15 21.35,16.35 21.35,16.45 21.15,16.65 21.15,17.3 21.25,17.45 27.7,17.45 29.2,18.9 U1.47
O6
  Top 0.127: U1.49 30,18.8 29.95,18.75 29.95,18.6 27.8,16.45 27,16.45 26.85,16.55 25.05,16.55 24.8,16.3 24.8,15.62 UD2.P$10
O7
  Top 0.127: 30.7,20.1 30.7,19.1 30.3,18.7 30.1,18.35 27.9,16.15 25.95,16.15 25.43,15.82 UD2.P$9
  Top 0.2: 30.7,20.1 U1.50
Q0C  (via drill 0.3)
  Top 0.127: U1.10 v27.2,27 | v11.05,32.1 11.05,31 Q0.4
  Route15 0.127: v27.2,27 16.15,27 v11.05,32.1
Q0D  (via drill 0.3)
  Top 0.127: Q0.3 v12,32.1 | v27.65,26.2 27.65,26.6 27.75,26.75 27.75,27.15 27.6,27.3 U1.9
  Route15 0.127: v12,32.1 12,31.65 16.3,27.35 26.5,27.35 26.7,27.55 27.35,27.55 27.8,27.1 27.8,26.35 v27.65,26.2
Q0GND
  Top 0.254: Q0.1 15.1,30.95 15.6,30.35 U3.D1
Q0PWR
  Top 0.127: 23.15,24.3 24.4,24.3 24.4,26.1 23.75,26.75 21.45,26.75 19.5,28.7 16.35,28.7 16.1,28.45 U3.G1
  Top 0.2: 23.15,24.3 U1.23
Q1C
  Top 0.127: 18.1,30.75 18.1,30.2 18.7,29.6 24.5,29.6 25,29.1 26.3,29.1 26.4,29 U1.12
  Top 0.2: Q1.4 18.1,30.75
Q1D
  Top 0.127: 19.1,30.75 19.1,30.3 19.4,30 24.7,30 25.3,29.4 26.7,29.4 26.7,29.35 26.8,29.25 U1.11
  Top 0.2: Q1.3 19.1,30.75
Q1GND  (via drill 0.3)
  Top 0.254: U3.D2 18.4,28.15 v18.55,28
  Top 0.61: v21,32.15 Q1.1
  Route2 0.254: v18.55,28 21,30.45 v21,32.15
Q1PWR
  Top 0.127: 22.15,28 20.6,28 19.55,29.05 16.3,29.05 16.1,29.25 U3.G2
  Top 0.2: 22.15,28 U1.16
Q2C
  Top 0.127: Q2.4 25.2,30.7 25.2,30 25.5,29.7 26.9,29.7 27.2,29.4 28.5,29.4 28.8,29.1 U1.6
Q2D
  Top 0.127: 25.95,30.55 26.5,30 27,30 27.3,29.7 28.6,29.7 29.2,29.1 U1.5
  Top 0.2: Q2.3 25.95,30.55
Q2N
  Top 0.127: U1.56 29.55,25.95 30,26.4 30,29.3 28.35,30.95 Q2.1
Q2P
  Top 0.127: 26.95,30.55 27.5,30 28.8,30 29.6,29.2 U1.4
  Top 0.2: Q2.2 26.95,30.55
Q3C
  Top 0.127: 31.85,30.75 30.3,29.2 30.3,25.6 29.9,25.2 28.85,25.2
  Top 0.2: Q3.4 31.85,30.75 | 28.85,25.2 U1.57
Q3D
  Top 0.127: Q3.3 32.85,30.05 32.8,30 31.6,30 30.7,29.1 30.7,25.6 29.5,24.4 28.85,24.4
  Top 0.2: 28.85,24.4 U1.58
Q3N  (via drill 0.3)
  Top 0.127: 28.85,23.5 v29.8,23.5 29.75,23.55 U1.59 | Q3.1 v34.85,32.2
  Top 0.2: 28.85,23.5 U1.59
  Route2 0.127: v34.85,32.2 31.8,29.15 31.8,27.6 29.8,25.6 v29.8,23.5
Q3P  (via drill 0.3)
  Top 0.127: Q3.2 v33.95,32.25 | v31.3,27.8 31.2,27.9 U1.3
  Route2 0.127: v33.95,32.25 31.3,29.6 v31.3,27.8
SWDCLK  (via drill 0.3)
  Top 0.127: U1.53 32.1,19.2 32.1,16.95 31.64,16.44 SWCK.P1
  other vias: 31.75,16.44
SWDIO  (via drill 0.3)
  Top 0.127: SWD.P1 30.48,18.38 31.2,19.1 U1.51
  other vias: 30.48,16.44
USB_DN  (via drill 0.3)
  Top 0.127: USB.B7 v7.35,14.3 | v22.95,18.55 U1.34
  Top 0.2: USB.B7 5.7,14.3 5.4,14 5.4,13.6 5.7,13.3 USB.A7
  Route15 0.127: v7.35,14.3 7.2,14.3 7.2,17.05 9.6,19.95 21.9,19.95 v22.95,18.55
USB_DP  (via drill 0.3)
  Top 0.127: U1.35 v23.7,18.55 | v7.85,13.75 7.55,13.75 7.3,13.5
  Top 0.2: USB.A6 7,13.8 7.3,13.5 7.3,13 7,12.8 USB.B6
  Route15 0.127: v23.7,18.55 23.75,18.6 23.3,18.05 22.45,18.05 21.35,19.6 9.7,19.6 7.55,16.95 7.55,14.8 7.85,14.55 v7.85,13.75
USB_VBUS  (via drill 0.3)
  Top 0.127: U1.32 22.5,19.95 v22.95,20.25 | 5.19,23.99 R2.1
  Top 0.305: U4.4 7,23.99 | 6.7,23.99 5.19,23.99 | 7,23.99 7,21.9 6.4,21.2 6.4,20.74 v6.4,19.5 6.4,19.4 7.4,17.6 8.15,17.5 F1.2 | 7,23.99 6.7,23.99 | 6.7,23.99 v6.7,27.3
  Route15 0.127: v22.95,20.25 7.05,20.25 v6.4,19.5
  Bottom 0.305: v6.7,27.3 6.8,27.12 JUMPER_USB_PWR.P$1
VBAT  (via drill 0.3)
  Top 0.406: v6.8,29.5 6.8,29 6.5,28.7
  Top 0.61: 9.1,28.5 9.3,28.7
  Top 0.813: BAT.2 6.5,28.7 9.3,28.7 9.75,28.7 D3.A
  Bottom 0.406: JUMPER_LIPO_PWR.P$1 6.84,29.64 v6.8,29.5
  Bottom 0.61: JUMPER_LIPO_CHG.P$2 6.81,30.57 JUMPER_LIPO_PWR.P$1
VBUS  (via drill 0.3)
  Top 0.2: USB.A4_B9 7.6,15.95 F1.1
  Top 0.406: USB.A4_B9 6.3,16 v5.1,15.7 | v5.1,11.45 5.05,11.4 USB.B4_A9
  Route15 0.406: v5.1,15.7 v5.1,11.45
VCC  (via drill 0.3)
  Top 0.127: v23.4,21 22.85,21.55 U1.30 | D1.4 15.19,26.5 U2.2
  Top 0.406: 22.2,21.9 U1.28 | U1.30 22.2,21.9 | 22.2,21.9 22.15,21.95 21.25,21.95 20.2,20.9 | 20.2,20.9 20.1,20.8 C2.2 | 20.2,20.9 19.65,21.45 15.95,21.45 C1.2 15.3,21.7 15.3,21.9 14,23.2 14,25.25 | v5,22.6 4,22.6 3,21.6 BTN.1 | 15.19,26.5 14.7,26.5 14,25.8 14,25.25 | 14,25.25 v13.6,25.25 | Q0.2 v13,32.3
  Top 0.61: Q1.2 v20,32.15
  Route2 0.127: VCC.P1 29.6,17.02 29.6,21.05 28.25,22.4 25.95,22.4 25.1,21.55 23.9,21.55 23.4,21.05 v23.4,21
  Route2 0.406: v5,22.6 7.65,25.25 v13.6,25.25 14.6,25.25 20,30.65 | v13,32.3 13.1,32.4 19.5,32.4 19.75,32.15 v20,32.15
  Route2 0.61: v20,32.15 20,30.65
  Bottom 0.127: VCC6.P1 23.88,28.77 21.2,31.45 20.7,31.45 v20,32.15
  other vias: 29.21,16.44

### Text on the board
tNames: + | Chrg | LED | Jolt.js 1.0f | 3 D C 0 | DBG
bNames: 0+DC | 0+DC | 0+DC | 0+DC | JST / LiPo | LiPo Pwr | LiPo Chg | USB Pwr | espruino.com/Jolt.js v1.0f | 18V / MAX | 0 | NFC Tune | 1 | NFC | GND | A | A | A | A | H7 / H6 / H5 / H4 / H3 / H2 / H1 / H0 / +V